# Altium project MotorControl.PrjPcb (part 2 of 2)

## Sheet HVin.SchDoc
size A; SheetNumber: 5; SheetTotal: 5
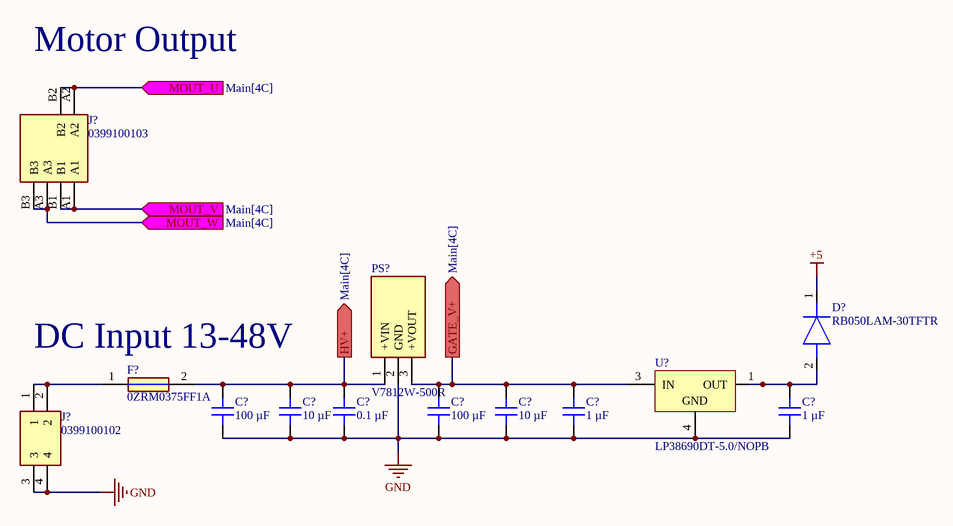
[diagram p3: HVin.SchDoc]

### Parts
(Parts that share a designator on the sheet are numbered #1, #2 ... from top to bottom, then left to right.)
C?#27  100 µF  [CAP 1206_3216 - 0.8MM]
C?#28  10 µF  [CAP 1206_3216 - 0.8MM]
C?#29  0.1 µF  [CAP 1206_3216 - 0.8MM]
C?#30  100 µF  [CAP 1206_3216 - 0.8MM]
C?#31  10 µF  [CAP 1206_3216 - 0.8MM]
C?#32  1 µF  [CAP 1206_3216 - 0.8MM]
C?#33  1 µF  [CAP 1206_3216 - 0.8MM]
D?#7  RB050LAM-30TFTR  [SODFL4725X95N]
F?#2  0ZRM0375FF1A  [0ZRM0375FF1A]
J?#3  0399100103  [0399100103]
J?#4  0399100102  [0399100102]
PS?  V7812W-500R  [V78121000R]
U?#2  LP38690DT-5.0/NOPB  [NDP0003B_M]

### Ports
GATE_V+ (out, see Main[4C]), HV+ (out, see Main[4C]), MOUT_U (in, see Main[4C]), MOUT_V (in, see Main[4C]), MOUT_W (in, see Main[4C])

### Nets
+5: D?#7.1(K)
GND: C?#27.1 C?#28.1 C?#29.1 C?#30.1 C?#31.1 C?#32.1 C?#33.1 J?#4.3 J?#4.4 PS?.2(GND) U?#2.4(GND)
12VOUT: C?#30.2 C?#31.2 C?#32.2 PS?.3(+VOUT) U?#2.3(IN) ; port GATE_V+
NetC?#27_2: C?#27.2 C?#28.2 C?#29.2 F?#2.2 PS?.1(+VIN) ; port HV+
NetC?#33_2: C?#33.2 D?#7.2(A) U?#2.1(OUT)
NetF?#2_1: F?#2.1 J?#4.1 J?#4.2
NetJ?#3_A1: J?#3.A1 J?#3.B1 ; port MOUT_V
NetJ?#3_A2: J?#3.A2 J?#3.B2 ; port MOUT_U
NetJ?#3_A3: J?#3.A3 J?#3.B3 ; port MOUT_W

### Notes on the sheet
- Motor Output
- DC Input 13-48V

### Library data of the parts
C?#27 C?#30 = C3216X5R0J107M160AB: CAP CER 100UF 6.3V X5R 1206; manufacturer: TDK Corporation; Tolerance: ±20%; Part Number: C3216X5R0J107M160AB; Value: 100 µF; Applications: General Purpose; Capacitance: 100 µF; componentlink1description: Datasheet; componentlink1url: https://product.tdk.com/info/en/catalog/datasheets/mlcc_commercial_general_en.pdf?ref_disty=digikey; componentlink2description: DigiKey Link; componentlink2url: https://www.digikey.com/en/products/detail/tdk-corporation/C3216X5R0J107M160AB/2443486; Device Package: 1206 (3216 Metric); Features: Low ESL; lastupdated: 2/6/2023 8:14:29 PM; Lifecycle Status: Active; Minimum Order: 1; Mounting Type: Surface Mount, MLCC; Operating Temperature: -55°C ~ 85°C; Package / Case: 1206 (3216 Metric); packaging: TapeAndReel; partid: 21199; Part Status: Active; price: 0.29; series: C; Size / Dimension: 0.126" L x 0.063" W (3.20mm x 1.60mm); Supplier 1: DigiKey; Supplier Part Number 1: 445-6008-1-ND; Temperature Coefficient: X5R; Thickness (Max): 0.075" (1.90mm); Voltage - Rated: 6.3V
C?#28 C?#31 = GRM31CR71E106KA12K: CAP CER 10UF 25V X7R 1206; manufacturer: Murata Electronics; Tolerance: ±10%; Part Number: GRM31CR71E106KA12K; Value: 10 µF; Applications: General Purpose; Capacitance: 10 µF; componentlink1description: Datasheet; componentlink1url: https://search.murata.co.jp/Ceramy/image/img/A01X/G101/ENG/GRM31CR71E106KA12-01.pdf; componentlink2description: DigiKey Link; componentlink2url: https://www.digikey.com/en/products/detail/murata-electronics/GRM31CR71E106KA12K/4905618; Device Package: 1206 (3216 Metric); lastupdated: 2/6/2023 8:14:40 PM; Lifecycle Status: Active; Minimum Order: 1; Mounting Type: Surface Mount, MLCC; Operating Temperature: -55°C ~ 125°C; Package / Case: 1206 (3216 Metric); packaging: TapeAndReel; partid: 19493; Part Status: Active; price: 0.06; series: GRM; Size / Dimension: 0.126" L x 0.063" W (3.20mm x 1.60mm); Supplier 1: DigiKey; Supplier Part Number 1: 490-14678-1-ND; Temperature Coefficient: X7R; Thickness (Max): 0.071" (1.80mm); Voltage - Rated: 25V
C?#29 = CC1206MRY5V9BB104: CAP CER 0.1UF 50V Y5V 1206; manufacturer: Yageo; Temperature Coefficient: Y5V (F); Tolerance: ±20%; Part Number: CC1206MRY5V9BB104; Value: 0.1 µF; Applications: General Purpose; Capacitance: 0.1 µF; componentlink1description: Datasheet; componentlink1url: http://www.yageo.com/documents/recent/UPY-GPHC_Y5V_6.3V-to-50V_8.pdf; componentlink2description: DigiKey Link; componentlink2url: https://www.digikey.com/en/products/detail/yageo/CC1206MRY5V9BB104/5884674; Device Package: 1206 (3216 Metric); lastupdated: 2/6/2023 8:14:35 PM; Lifecycle Status: Active; Minimum Order: 1; Mounting Type: Surface Mount, MLCC; Operating Temperature: -30°C ~ 85°C; Package / Case: 1206 (3216 Metric); packaging: TapeAndReel; partid: 18711; Part Status: Active; price: 0.05; series: CC; Size / Dimension: 0.126" L x 0.063" W (3.20mm x 1.60mm); Supplier 1: DigiKey; Supplier Part Number 1: 311-4504-1-ND; Thickness (Max): 0.028" (0.70mm); Voltage - Rated: 50V
C?#32 C?#33 = CC1206KKX7R8BB105: CAP CER 1UF 25V X7R 1206; manufacturer: Yageo; Tolerance: ±10%; Part Number: CC1206KKX7R8BB105; Value: 1 µF; Applications: General Purpose; Capacitance: 1 µF; componentlink1description: Datasheet; componentlink1url: https://www.yageo.com/upload/media/product/productsearch/datasheet/mlcc/UPY-GPHC_X7R_6.3V-to-50V_18.pdf; componentlink2description: DigiKey Link; componentlink2url: https://www.digikey.com/en/products/detail/yageo/CC1206KKX7R8BB105/2103094; Device Package: 1206 (3216 Metric); lastupdated: 2/6/2023 8:14:35 PM; Lifecycle Status: Active; Minimum Order: 1; Mounting Type: Surface Mount, MLCC; Operating Temperature: -55°C ~ 125°C; Package / Case: 1206 (3216 Metric); packaging: TapeAndReel; partid: 18923; Part Status: Active; price: 0.03; series: CC; Size / Dimension: 0.126" L x 0.063" W (3.20mm x 1.60mm); Supplier 1: DigiKey; Supplier Part Number 1: 311-1356-1-ND; Temperature Coefficient: X7R; Thickness (Max): 0.045" (1.15mm); Voltage - Rated: 25V
D?#7 = RB050LAM-30TFTR: Diode; Manufacturer_Name: ROHM Semiconductor; Datasheet Link: https://componentsearchengine.com/Datasheets/1/RB050LAM-30TFTR.pdf; Height: 0.95mm; Manufacturer_Part_Number: RB050LAM-30TFTR; Mouser Part Number: 755-RB050LAM-30TFTR; Mouser Price/Stock: https://www.mouser.co.uk/ProductDetail/ROHM-Semiconductor/RB050LAM-30TFTR?qs=HXFqYaX1Q2xO84kRCTSWAQ%3D%3D
F?#2 = 0ZRM0375FF1A: Fuse; Manufacturer_Name: BelFuse; Datasheet Link: https://www.mouser.com/datasheet/2/643/ds-CP-0zrm-series-1664109.pdf; Height: 34mm; Manufacturer_Part_Number: 0ZRM0375FF1A; Mouser Part Number: 530-0ZRM0375FF1A; Mouser Price/Stock: https://www.mouser.co.uk/ProductDetail/Bel-Fuse/0ZRM0375FF1A?qs=MvPYbBWWJyvr16E%252BkpbJXQ%3D%3D
J?#3 = 0399100103: Connector; Manufacturer_Name: Molex; Datasheet Link: https://www.molex.com/pdm_docs/sd/399100103_sd.pdf; Height: 30mm; Manufacturer_Part_Number: 0399100103; Mouser Part Number: N/A; Mouser Price/Stock: https://www.mouser.co.uk/ProductDetail/Molex/0399100103?qs=%252BdQmOuGyFcE%2Fyr5UJhNqQA%3D%3D; Arrow Part Number: 0399100103; Arrow Price/Stock: https://www.arrow.com/en/products/0399100103/molex?region=nac
J?#4 = 0399100102: Connector; Manufacturer_Name: Molex; Datasheet Link: https://www.molex.com/pdm_docs/sd/399100102_sd.pdf; Height: 29.7mm; Manufacturer_Part_Number: 0399100102; Mouser Part Number: N/A; Mouser Price/Stock: https://www.mouser.co.uk/ProductDetail/Molex/0399100102?qs=PBcRNPEHKso3EAnX8hJm1w%3D%3D; Arrow Part Number: 0399100102; Arrow Price/Stock: https://www.arrow.com/en/products/0399100102/molex
PS? = V7812W-500R: Power Supply; Manufacturer_Name: CUI Inc.; Datasheet Link: https://www.cui.com/product/resource/v78xx-1000.pdf; Height: 9mm; Manufacturer_Part_Number: V7812W-500R; Mouser Part Number: 490-V7812W-500R; Mouser Price/Stock: https://www.mouser.co.uk/ProductDetail/CUI-Inc/V7812W-500R?qs=WyjlAZoYn5223%2F9I6AQjMw%3D%3D; Arrow Part Number: V7812W-500R; Arrow Price/Stock: https://www.arrow.com/en/products/v7812w-500r/cui-inc
U?#2 = CMP-0062-00280-3: 1A Low Dropout CMOS Linear Regulators Stable with Ceramic Output Capacitors, 3-pin TO-252, Pb-Free; Manufacturer: Texas Instruments; PackageTopMarking: NSUZXYTT*LP38690*DT-5.0; CompType: LDO IC; PowerWise: Y; ComponentLink1URL: http://www.ti.com/general/docs/lit/getliterature.tsp?genericPartNumber=LP38690&fileType=pdf; RoHS: Y; ComponentLink1Description: Datasheet URL; PackageDescription: TO252, Molded, Jedec, 6.8 x 6.10 x 2.30mm Body, 3 Lead, 2.28mm Pitch, Surface Mount; Code_JEDEC: TO-252-AA; PinCount: 3; PackageReference: NDP0003B

## Sheet Gating.SchDoc
size A; SheetNumber: 4; SheetTotal: 6
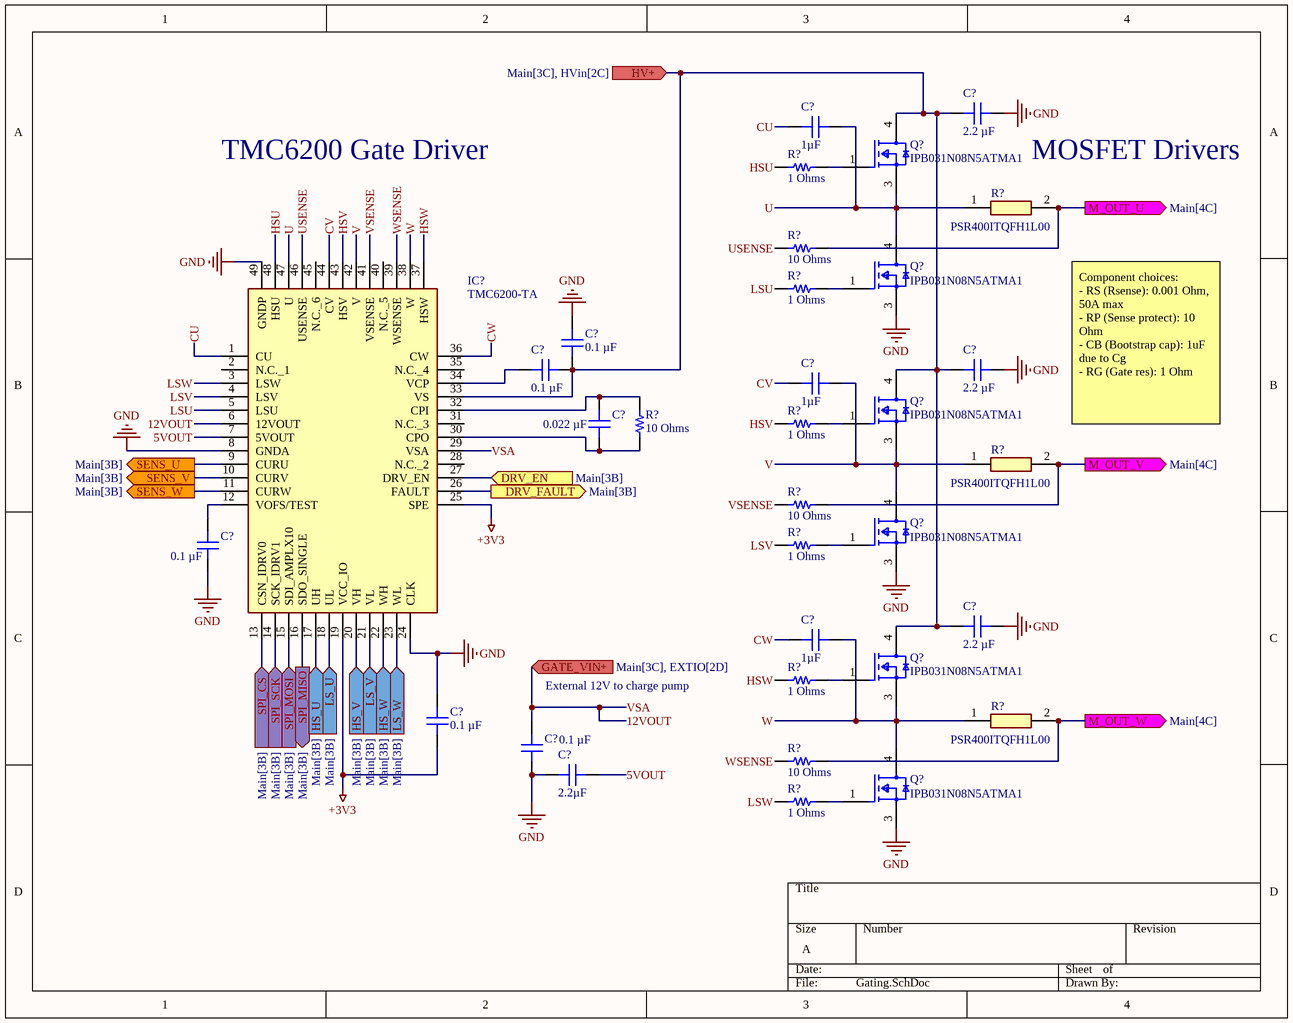
[diagram p4: Gating.SchDoc]

### Parts
(Parts that share a designator on the sheet are numbered #1, #2 ... from top to bottom, then left to right.)
C?#34  2.2 µF  [CAP 0805_2012]
C?#35  1µF  [CAP 1210_3225 - 2.8MM]
C?#36  0.1 µF  [CAP 1206_3216 - 0.8MM]
C?#37  0.1 µF  [CAP 1206_3216 - 0.8MM]
C?#38  2.2 µF  [CAP 0805_2012]
C?#39  1µF  [CAP 1210_3225 - 2.8MM]
C?#40  0.022 µF  [CAP 1206_3216 - 0.8MM]
C?#41  0.1 µF  [CAP 0603_1608]
C?#42  2.2 µF  [CAP 0805_2012]
C?#43  1µF  [CAP 1210_3225 - 2.8MM]
C?#44  0.1 µF  [CAP 0603_1608]
C?#45  0.1 µF  [CAP 1206_3216 - 0.8MM]
C?#46  2.2µF  [CAP 1206_3216 - 1.2MM]
IC?#4  TMC6200-TA  [QFP50P900X900X120-49N]
Q?#2  IPB031N08N5ATMA1  [FP-PG-TO263-3-MFG]
Q?#3  IPB031N08N5ATMA1  [FP-PG-TO263-3-MFG]
Q?#4  IPB031N08N5ATMA1  [FP-PG-TO263-3-MFG]
Q?#5  IPB031N08N5ATMA1  [FP-PG-TO263-3-MFG]
Q?#6  IPB031N08N5ATMA1  [FP-PG-TO263-3-MFG]
Q?#7  IPB031N08N5ATMA1  [FP-PG-TO263-3-MFG]
R?#15  1 Ohms  [RES 1210_3225]
R?#16  PSR400ITQFH1L00  [RESC10052X105N]
R?#17  10 Ohms  [RES 1210_3225]
R?#18  1 Ohms  [RES 1210_3225]
R?#19  10 Ohms  [RES 0603_1608]
R?#20  1 Ohms  [RES 1210_3225]
R?#21  PSR400ITQFH1L00  [RESC10052X105N]
R?#22  10 Ohms  [RES 1210_3225]
R?#23  1 Ohms  [RES 1210_3225]
R?#24  1 Ohms  [RES 1210_3225]
R?#25  PSR400ITQFH1L00  [RESC10052X105N]
R?#26  10 Ohms  [RES 1210_3225]
R?#27  1 Ohms  [RES 1210_3225]

### Ports
DRV_EN (in, see Main[3B]), DRV_FAULT (out, see Main[3B]), GATE_VIN+ (in, see Main[3C], EXTIO[2D]), HS_U (in, see Main[3B]), HS_V (in, see Main[3B]), HS_W (in, see Main[3B]), HV+ (in, see Main[3C], HVin[2C]), LS_U (in, see Main[3B]), LS_V (in, see Main[3B]), LS_W (in, see Main[3B]), M_OUT_U (out, see Main[4C]), M_OUT_V (out, see Main[4C]), M_OUT_W (out, see Main[4C]), SENS_U (out, see Main[3B]), SENS_V (out, see Main[3B]), SENS_W (out, see Main[3B]), SPI_CS (in, see Main[3B]), SPI_MISO (out, see Main[3B]), SPI_MOSI (in, see Main[3B]), SPI_SCK (in, see Main[3B])

### Nets
+3V3: C?#44.1 IC?#4.19(VCC_IO) IC?#4.25(SPE)
GND: C?#34.1 C?#36.2 C?#38.1 C?#41.1 C?#42.1 C?#44.2 C?#45.1 C?#46.1 IC?#4.8(GNDA) IC?#4.24(CLK) IC?#4.49(GNDP) Q?#3.3(S) Q?#5.3(S) Q?#7.3(S)
5VOUT: C?#46.2 IC?#4.7(5VOUT)
12VOUT: C?#45.2 IC?#4.6(12VOUT) IC?#4.29(VSA) ; port GATE_VIN+  [also labelled VSA]
CU: C?#35.1 IC?#4.1(CU)
CV: C?#39.1 IC?#4.44(CV)
CW: C?#43.1 IC?#4.36(CW)
HSU: IC?#4.48(HSU) R?#15.1
HSV: IC?#4.43(HSV) R?#20.1
HSW: IC?#4.37(HSW) R?#24.1
LSU: IC?#4.5(LSU) R?#18.1
LSV: IC?#4.4(LSV) R?#23.1
LSW: IC?#4.3(LSW) R?#27.1
U: C?#35.2 IC?#4.47(U) Q?#2.3(S) Q?#3.4(D) R?#16.1
USENSE: IC?#4.46(USENSE) R?#17.1
V: C?#39.2 IC?#4.42(V) Q?#4.3(S) Q?#5.4(D) R?#21.1
VSENSE: IC?#4.41(VSENSE) R?#22.1
W: C?#43.2 IC?#4.38(W) Q?#6.3(S) Q?#7.4(D) R?#25.1
WSENSE: IC?#4.39(WSENSE) R?#26.1
NetC?#27_2: C?#34.2 C?#36.1 C?#37.2 C?#38.2 C?#42.2 IC?#4.33(VS) Q?#2.4(D) Q?#4.4(D) Q?#6.4(D) ; port HV+
NetC?#37_1: C?#37.1 IC?#4.34(VCP)
NetC?#40_1: C?#40.1 IC?#4.30(CPO) R?#19.1
NetC?#40_2: C?#40.2 IC?#4.32(CPI) R?#19.2
NetC?#41_2: C?#41.2 IC?#4.12(VOFS/TEST)
NetIC?#4_9: IC?#4.9(CURU) ; port SENS_U
NetIC?#4_10: IC?#4.10(CURV) ; port SENS_V
NetIC?#4_11: IC?#4.11(CURW) ; port SENS_W
NetIC?#4_13: IC?#4.13(CSN_IDRV0) ; port SPI_CS
NetIC?#4_14: IC?#4.14(SCK_IDRV1) ; port SPI_SCK
NetIC?#4_15: IC?#4.15(SDI_AMPLX10) ; port SPI_MOSI
NetIC?#4_16: IC?#4.16(SDO_SINGLE) ; port SPI_MISO
NetIC?#4_17: IC?#4.17(UH) ; port HS_U
NetIC?#4_18: IC?#4.18(UL) ; port LS_U
NetIC?#4_20: IC?#4.20(VH) ; port HS_V
NetIC?#4_21: IC?#4.21(VL) ; port LS_V
NetIC?#4_22: IC?#4.22(WH) ; port HS_W
NetIC?#4_23: IC?#4.23(WL) ; port LS_W
NetIC?#4_26: IC?#4.26(FAULT) ; port DRV_FAULT
NetIC?#4_27: IC?#4.27(DRV_EN) ; port DRV_EN
NetJ?#3_A1: R?#21.2 R?#22.2 ; port M_OUT_V
NetJ?#3_A2: R?#16.2 R?#17.2 ; port M_OUT_U
NetJ?#3_A3: R?#25.2 R?#26.2 ; port M_OUT_W
NetQ?#2_1: Q?#2.1(G) R?#15.2
NetQ?#3_1: Q?#3.1(G) R?#18.2
NetQ?#4_1: Q?#4.1(G) R?#20.2
NetQ?#5_1: Q?#5.1(G) R?#23.2
NetQ?#6_1: Q?#6.1(G) R?#24.2
NetQ?#7_1: Q?#7.1(G) R?#27.2

Not connected (* = marked no-connect by the designer): IC?#4 2(N.C._1) 28(N.C._2) 31(N.C._3) 35(N.C._4) 40(N.C._5) 45(N.C._6)

### Notes on the sheet
- TMC6200 Gate Driver
- MOSFET Drivers
- Component choices:
  - RS (Rsense): 0.001 Ohm, 50A max
  - RP (Sense protect): 10 Ohm
  - CB (Bootstrap cap): 1uF due to Cg
  - RG (Gate res): 1 Ohm
- (near C?#45) External 12V to charge pump

### Library data of the parts
C?#34 C?#38 C?#42 = GRM21BD72A225KE01L: CAP CER 2.2UF 100V X7T 0805; manufacturer: Murata Electronics; Tolerance: ±10%; Part Number: GRM21BD72A225KE01L; Value: 2.2 µF; Applications: General Purpose; Capacitance: 2.2 µF; componentlink1description: Datasheet; componentlink1url: https://search.murata.co.jp/Ceramy/image/img/A01X/G101/ENG/GRM21BD72A225KE01-01A.pdf; componentlink2description: DigiKey Link; componentlink2url: https://www.digikey.com/en/products/detail/murata-electronics/GRM21BD72A225KE01L/16033492; Device Package: 0805 (2012 Metric); lastupdated: 2/6/2023 8:10:57 PM; Lifecycle Status: Active; Minimum Order: 1; Mounting Type: Surface Mount, MLCC; Operating Temperature: -55°C ~ 125°C; Package / Case: 0805 (2012 Metric); packaging: TapeAndReel; partid: 42420; Part Status: Active; price: 0.13; series: GRM; Size / Dimension: 0.079" L x 0.049" W (2.00mm x 1.25mm); Supplier 1: DigiKey; Supplier Part Number 1: 490-GRM21BD72A225KE01LCT-ND; Temperature Coefficient: X7T; Thickness (Max): 0.057" (1.45mm); Voltage - Rated: 100V
C?#35 C?#39 C?#43 = 12101C105MAT2A: CAP CER 1UF 100V X7R 1210; manufacturer: AVX Corporation; Tolerance: ±20%; Part Number: 12101C105MAT2A; Value: 1µF; Applications: General Purpose; Capacitance: 1µF; componentlink1description: Datasheet; componentlink1url: http://datasheets.avx.com/X7RDielectric.pdf; componentlink2description: DigiKey Link; componentlink2url: http://digikey.com/product-detail/en/avx-corporation/12101C105MAT2A/478-2571-1-ND/717516; Device Package: 1210 (3225 Metric); lastupdated: 9/2/2020 1:10:52 AM; Lifecycle Status: Active; Minimum Order: 1; Mounting Type: Surface Mount, MLCC; Operating Temperature: -55°C ~ 125°C; Package / Case: 1210 (3225 Metric); packaging: TapeAndReel; partid: 23736; Part Status: Active; price: 0.21; series: -; Size / Dimension: 0.126" L x 0.098" W (3.20mm x 2.50mm); Supplier 1: DigiKey; Supplier Part Number 1: 478-2571-1-ND; Temperature Coefficient: X7R; Thickness (Max): 0.110" (2.79mm); Voltage - Rated: 100V
C?#36 C?#37 C?#45 = CC1206MRY5V9BB104: as C?#29 on sheet HVin; Part Number: CC1206MRY5V9BB104; Value: 0.1 µF; Applications: General Purpose; Capacitance: 0.1 µF; componentlink1description: Datasheet; componentlink1url: http://www.yageo.com/documents/recent/UPY-GPHC_Y5V_6.3V-to-50V_8.pdf; componentlink2description: DigiKey Link; componentlink2url: https://www.digikey.com/en/products/detail/yageo/CC1206MRY5V9BB104/5884674; Device Package: 1206 (3216 Metric); lastupdated: 2/6/2023 8:14:35 PM; Lifecycle Status: Active; Minimum Order: 1; Mounting Type: Surface Mount, MLCC; Operating Temperature: -30°C ~ 85°C; Package / Case: 1206 (3216 Metric); packaging: TapeAndReel; partid: 18711; Part Status: Active; price: 0.05; series: CC; Size / Dimension: 0.126" L x 0.063" W (3.20mm x 1.60mm); Supplier 1: DigiKey; Supplier Part Number 1: 311-4504-1-ND; Thickness (Max): 0.028" (0.70mm); Voltage - Rated: 50V
C?#40 = C1206C223K1RECAUTO: CAP CER 1206 22NF 100V X7R 10%; manufacturer: KEMET; Part Number: C1206C223K1RECAUTO; Value: 0.022 µF; Applications: Automotive, ESD Protection; Capacitance: 0.022 µF; componentlink1description: Datasheet; componentlink1url: https://api.kemet.com/component-edge/download/datasheet/C1206C223K1RECAUTO.pdf; componentlink2description: DigiKey Link; componentlink2url: https://www.digikey.com/en/products/detail/kemet/C1206C223K1RECAUTO/8640492; Device Package: 1206 (3216 Metric); lastupdated: 2/6/2023 8:14:07 PM; Lifecycle Status: Active; Minimum Order: 1; Mounting Type: Surface Mount, MLCC; Operating Temperature: -55°C ~ 125°C; Package / Case: 1206 (3216 Metric); packaging: TapeAndReel; partid: 21022; Part Status: Active; price: 0.03; Ratings: AEC-Q200; series: ESD SMD Auto X7R; Size / Dimension: 0.126" L x 0.063" W (3.20mm x 1.60mm); Supplier 1: DigiKey; Supplier Part Number 1: 399-17898-1-ND; Temperature Coefficient: X7R; Thickness (Max): 0.035" (0.88mm); Tolerance: ±10%; Voltage - Rated: 100V
C?#41 C?#44 = CS0603KRX7R7BB104: CAP CER 0.1UF 16V X7R 0603; manufacturer: Yageo; Tolerance: ±10%; Part Number: CS0603KRX7R7BB104; Value: 0.1 µF; Applications: Boardflex Sensitive; Capacitance: 0.1 µF; componentlink1description: Datasheet; componentlink1url: http://www.yageo.com/NewPortal/yageodocoutput?fileName=/pdf/MLCC/UPY-ST_NPOX7R_16V-to-3KV_5.pdf; componentlink2description: DigiKey Link; componentlink2url: https://www.digikey.com/en/products/detail/yageo/CS0603KRX7R7BB104/6097897; Device Package: 0603 (1608 Metric); Features: Soft Termination; lastupdated: 2/6/2023 8:08:52 PM; Lifecycle Status: Active; Minimum Order: 1; Mounting Type: Surface Mount, MLCC; Operating Temperature: -55°C ~ 125°C; Package / Case: 0603 (1608 Metric); packaging: TapeAndReel; partid: 2286; Part Status: Active; price: 0.01; series: CS; Size / Dimension: 0.063" L x 0.031" W (1.60mm x 0.80mm); Supplier 1: DigiKey; Supplier Part Number 1: 311-3560-1-ND; Temperature Coefficient: X7R; Thickness (Max): 0.037" (0.95mm); Voltage - Rated: 16V
C?#46 = 12063G225ZAT4A: CAP CER 2.2UF 25V Y5V 1206; manufacturer: AVX Corporation; Temperature Coefficient: Y5V (F); Tolerance: -20%, +80%; Part Number: 12063G225ZAT4A; Value: 2.2µF; Applications: General Purpose; Capacitance: 2.2µF; componentlink1description: Datasheet; componentlink1url: http://datasheets.avx.com/Y5V.pdf; componentlink2description: DigiKey Link; componentlink2url: http://digikey.com/product-detail/en/avx-corporation/12063G225ZAT4A/478-12479-1-ND/9749331; Device Package: 1206 (3216 Metric); lastupdated: 9/2/2020 1:05:10 AM; Lifecycle Status: Active; Minimum Order: 1; Mounting Type: Surface Mount, MLCC; Operating Temperature: -30°C ~ 85°C; Package / Case: 1206 (3216 Metric); packaging: TapeAndReel; partid: 18984; Part Status: Active; price: 0.09; series: -; Size / Dimension: 0.126" L x 0.063" W (3.20mm x 1.60mm); Supplier 1: DigiKey; Supplier Part Number 1: 478-12479-1-ND; Thickness (Max): 0.040" (1.02mm); Voltage - Rated: 25V
IC?#4 = TMC6200-TA: Integrated Circuit; Manufacturer_Name: Trinamic Motion Control GmbH; Datasheet Link: https://datasheet.datasheetarchive.com/originals/distributors/Datasheets_SAMA/f9acd441643b32190a486ba2a99356a2.pdf; Height: 1.2mm; Manufacturer_Part_Number: TMC6200-TA
Q?#2-Q?#7 = CMP-32901-001127-1: MOSFET N-CH 80V 120A D2PAK; Element Configuration: Single; Gate to Source Voltage (Vgs): 20V; Rise Time: 18ns; Rds On Max: 3.1mR; Drain to Source Resistance: 4.1mR; Number of Channels: 1; Fall Time: 12ns; Max Power Dissipation: 167W; Turn-Off Delay Time: 37ns; Polarity: N-CHANNEL; Input Capacitance: 6.24nF; Max Operating Temperature: 175°C; Packaging: Tape and Reel; Package Quantity: 1000; Lead Free: Contains Lead; Min Operating Temperature: -55°C; Drain to Source Voltage (Vdss): 80V; Mount: Surface Mount; Max Dual Supply Voltage: 80V; RoHS Compliant: Yes; Weight: 0.139332oz; Turn-On Delay Time: 18ns; Halogen Free: Halogen Free; Drain to Source Breakdown Voltage: 80V; Series: OptiMOS™; Case/Package: TO-263-3; Continuous Drain Current (ID): 120A; Number of Pins: 3
R?#15 R?#18 R?#20 R?#23 R?#24 R?#27 = RK73B2ETTD1R0J: RES 1 OHM 5% 1/2W 1210; Manufacturer: KOA Speer Electronics, Inc.; Power (Watts): 0.5W, 1/2W; Temperature Coefficient: ±200ppm/°C; Part Number: RK73B2ETTD1R0J; ComponentLink1Description: Datasheet; ComponentLink1URL: http://www.koaspeer.com/catimages/Products/RK73B/RK73B.pdf; ComponentLink2Description: DigiKey Link; ComponentLink2URL: https://www.digikey.com/en/products/detail/koa-speer-electronics-inc/RK73B2ETTD1R0J/10315032; Composition: Thick Film; Device Package: 1210 (3225 Metric); Features: Automotive AEC-Q200; Height - Seated (Max): 0.028" (0.70mm); LastUpdated: 2/6/2023 9:02:08 PM; Lifecycle Status: Active; Minimum Order: 1; Number of Terminations: 2; Operating Temperature: -55°C ~ 155°C; Package / Case: 1210 (3225 Metric); Packaging: TapeAndReel; Part Status: Active; Price: 0.02; Ratings: AEC-Q200; Resistance: 1 Ohms; Series: RK73B; Size / Dimension: 0.126" L x 0.063" W (3.20mm x 1.60mm); Supplier 1: DigiKey; Supplier Part Number 1: 2019-RK73B2ETTD1R0JCT-ND; Supplier Device Package: 1210; Tolerance: ±5%; Value: 1 Ohms
R?#16 R?#21 R?#25 = PSR400ITQFH1L00: Resistor; Manufacturer_Name: ROHM Semiconductor; Datasheet Link: https://datasheet.datasheetarchive.com/originals/distributors/DKDS-18/356551.pdf; Height: 1.05mm; Manufacturer_Part_Number: PSR400ITQFH1L00; Mouser Part Number: 755-PSR400ITQFH1L00; Mouser Price/Stock: https://www.mouser.co.uk/ProductDetail/ROHM-Semiconductor/PSR400ITQFH1L00?qs=493kPxzlxfKMrnsSE5rdTg%3D%3D
R?#17 R?#22 R?#26 = RN73R2ETTD10R0F25: RESISTOR THIN FILM 1210 SIZE; Manufacturer: KOA Speer Electronics, Inc.; Power (Watts): 0.25W, 1/4W; Temperature Coefficient: ±25ppm/°C; Tolerance: ±1%; Part Number: RN73R2ETTD10R0F25; ComponentLink1Description: Datasheet; ComponentLink1URL: https://www.koaspeer.com/pdfs/RN73R.pdf; ComponentLink2Description: DigiKey Link; ComponentLink2URL: https://www.digikey.com/en/products/detail/koa-speer-electronics-inc/RN73R2ETTD10R0F25/13211390; Composition: Metal Film; Device Package: 1210 (3225 Metric); Features: Automotive AEC-Q200, Moisture Resistant; Height - Seated (Max): 0.028" (0.70mm); LastUpdated: 2/6/2023 9:02:05 PM; Lifecycle Status: Active; Minimum Order: 1; Number of Terminations: 2; Operating Temperature: -55°C ~ 155°C; Package / Case: 1210 (3225 Metric); Packaging: TapeAndReel; Part Status: Active; Price: 0.16; Ratings: AEC-Q200; Resistance: 10 Ohms; Series: RN73R; Size / Dimension: 0.126" L x 0.098" W (3.20mm x 2.50mm); Supplier 1: DigiKey; Supplier Part Number 1: 2019-RN73R2ETTD10R0F25CT-ND; Supplier Device Package: 1210; Value: 10 Ohms
R?#19 = CPF0603B10RE: RES SMD 10 OHM 0.1% 1/16W 0603; Manufacturer: TE Connectivity Passive Product; Power (Watts): 0.063W, 1/16W; Temperature Coefficient: ±25ppm/°C; Part Number: CPF0603B10RE; Value: 10 Ohms; ComponentLink1Description: Datasheet; ComponentLink1URL: https://www.te.com/commerce/DocumentDelivery/DDEController?Action=srchrtrv&DocNm=1773200&DocType=DS&DocLang=English; ComponentLink2Description: DigiKey Link; ComponentLink2URL: https://www.digikey.com/en/products/detail/te-connectivity-passive-product/CPF0603B10RE/2381853; Composition: Thin Film; Device Package: 0603 (1608 Metric); Height - Seated (Max): 0.022" (0.55mm); LastUpdated: 2/5/2023 8:28:11 PM; Lifecycle Status: Active; Minimum Order: 1; Number of Terminations: 2; Operating Temperature: -55°C ~ 155°C; Package / Case: 0603 (1608 Metric); Packaging: TapeAndReel; PartId: 4879; Part Status: Active; Price: 0.09; Resistance: 10 Ohms; Series: CPF, Neohm; Size / Dimension: 0.061" L x 0.031" W (1.55mm x 0.80mm); Supplier 1: DigiKey; Supplier Part Number 1: A119908CT-ND; Supplier Device Package: 0603; Tolerance: ±0.1%

## Sheet EXTIO.SchDoc
size A; SheetNumber: 6; SheetTotal: 6
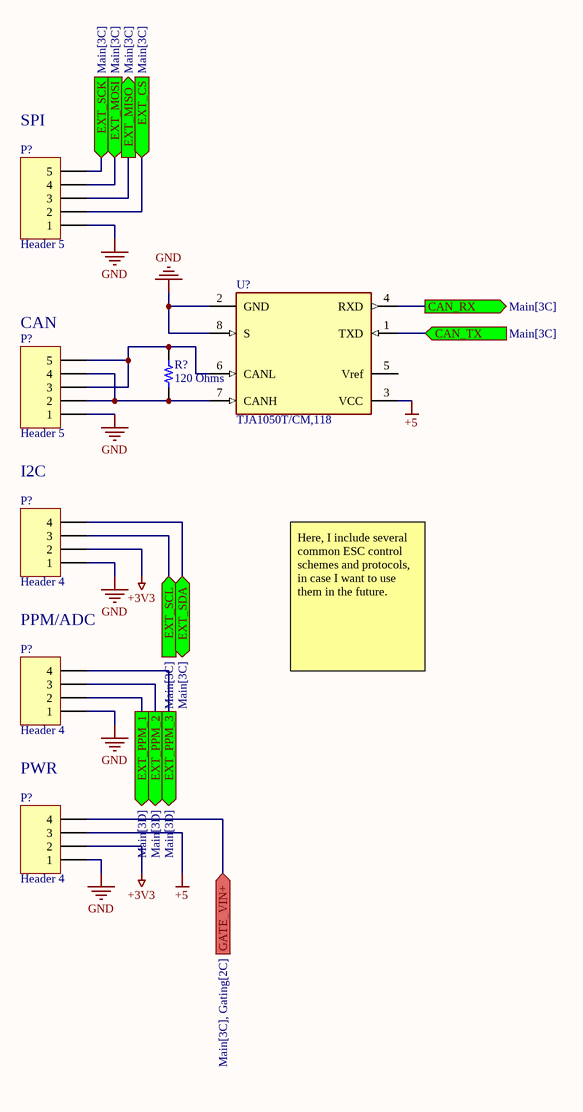
[diagram p5: EXTIO.SchDoc]

### Parts
(Parts that share a designator on the sheet are numbered #1, #2 ... from top to bottom, then left to right.)
P?#2  Header 5  [HDR1X5]
P?#3  Header 5  [HDR1X5]
P?#4  Header 4  [HDR1X4]
P?#5  Header 4  [HDR1X4]
P?#6  Header 4  [HDR1X4]
R?#28  120 Ohms  [RES 0603_1608]
U?#3  TJA1050T/CM,118  [FP-SOT96-1-IPC_A]

### Ports
CAN_RX (out, see Main[3C]), CAN_TX (in, see Main[3C]), EXT_CS (in, see Main[3C]), EXT_MISO (out, see Main[3C]), EXT_MOSI (in, see Main[3C]), EXT_PPM_1 (out, see Main[3D]), EXT_PPM_2 (out, see Main[3D]), EXT_PPM_3 (out, see Main[3D]), EXT_SCK (in, see Main[3C]), EXT_SCL (in, see Main[3C]), EXT_SDA (bidir, see Main[3C]), GATE_VIN+ (in, see Main[3C], Gating[2C])

### Nets
+3V3: P?#4.2 P?#6.2
+5: P?#6.3 U?#3.3(VCC)
GND: P?#2.1 P?#3.1 P?#4.1 P?#5.1 P?#6.1 U?#3.2(GND) U?#3.8(S)
12VOUT: P?#6.4 ; port GATE_VIN+
NetP?#2_2: P?#2.2 ; port EXT_CS
NetP?#2_3: P?#2.3 ; port EXT_MISO
NetP?#2_4: P?#2.4 ; port EXT_MOSI
NetP?#2_5: P?#2.5 ; port EXT_SCK
NetP?#3_2: P?#3.2 P?#3.4 R?#28.1 U?#3.7(CANH)
NetP?#3_3: P?#3.3 P?#3.5 R?#28.2 U?#3.6(CANL)
NetP?#4_3: P?#4.3 ; port EXT_SCL
NetP?#4_4: P?#4.4 ; port EXT_SDA
NetP?#5_2: P?#5.2 ; port EXT_PPM_1
NetP?#5_3: P?#5.3 ; port EXT_PPM_2
NetP?#5_4: P?#5.4 ; port EXT_PPM_3
NetU1_H13: U?#3.1(TXD) ; port CAN_TX
NetU1_M13: U?#3.4(RXD) ; port CAN_RX

Not connected (* = marked no-connect by the designer): U?#3 5(Vref)

### Notes on the sheet
- (near P?#2) SPI
- (near P?#3) CAN
- (near P?#4) I2C
- (near P?#5) PPM/ADC
- Here, I include several common ESC control schemes and protocols, in case I want to use them in the future.
- (near P?#6) PWR

### Library data of the parts
P?#2 P?#3 = Header 5: Header, 5-Pin; LatestRevisionDate: 17-Jul-2002; LatestRevisionNote: Re-released for DXP Platform.; Publisher: Altium Limited
P?#4-P?#6 = Header 4: Header, 4-Pin; LatestRevisionDate: 17-Jul-2002; LatestRevisionNote: Re-released for DXP Platform.; Publisher: Altium Limited
R?#28 = AC0603FR-07120RL: RES SMD 120 OHM 1% 1/10W 0603; Manufacturer: Yageo; Power (Watts): 0.1W, 1/10W; Temperature Coefficient: ±100ppm/°C; Part Number: AC0603FR-07120RL; Value: 120 Ohms; ComponentLink1Description: Datasheet; ComponentLink1URL: https://www.yageo.com/upload/media/product/productsearch/datasheet/rchip/PYu-AC_51_RoHS_L_7.pdf; ComponentLink2Description: DigiKey Link; ComponentLink2URL: https://www.digikey.com/en/products/detail/yageo/AC0603FR-07120RL/5895761; Composition: Thick Film; Device Package: 0603 (1608 Metric); Features: Automotive AEC-Q200, Moisture Resistant; Height - Seated (Max): 0.022" (0.55mm); LastUpdated: 2/5/2023 8:27:27 PM; Lifecycle Status: Active; Minimum Order: 1; Number of Terminations: 2; Operating Temperature: -55°C ~ 155°C; Package / Case: 0603 (1608 Metric); Packaging: CutTape; PartId: 17447; Part Status: Active; Price: 0.01; Ratings: AEC-Q200; Resistance: 120 Ohms; Series: AC; Size / Dimension: 0.063" L x 0.031" W (1.60mm x 0.80mm); Supplier 1: DigiKey; Supplier Part Number 1: YAG3563CT-ND; Supplier Device Package: 0603; Tolerance: ±1%
U?#3 = CMP-2000-04923-2: IC TRANSCEIVER HALF 1/1 8SO; Simplex/Duplex: Half Duplex; Max Supply Current: 10mA; Number of Receive Buffers: 1; Min Supply Voltage: 4.75V; Max Supply Voltage: 5.25V; Interface: CAN; Data Rate: 1Mbps; Receiver Hysteresis: 70mV; Number of Transmit Buffers: 1; Min Operating Temperature: -40°C; Case/Package: SO; REACH SVHC: No SVHC; Max Operating Temperature: 150°C; Number of Pins: 8; Lead Free: Lead Free; Number of Transceivers: 1; Packaging: Tape and Reel; Mount: Surface Mount; Radiation Hardening: No; Nominal Supply Current: 10mA; Package Quantity: 2500; Contact Plating: Gold

## Nets that join several sheets
+3V3: MCUCustom (17 pins), USBIO (7 pins), Gating (C?#44.1 IC?#4.19 IC?#4.25), EXTIO (P?#4.2 P?#6.2)
+5: MCUCustom (U1.N6 U1.P6), USBIO (11 pins), HVin (D?#7.1), EXTIO (P?#6.3 U?#3.3)
GND: MCUCustom (52 pins), USBIO (25 pins), HVin (11 pins), Gating (14 pins), EXTIO (7 pins)
12VOUT: HVin (5 pins), Gating (C?#45.2 IC?#4.6 IC?#4.29), EXTIO (P?#6.4)
HOST_D+: MCUCustom (U1.N7), USBIO (D?#6.4 J?#2.A6 J?#2.B6)
HOST_D-: MCUCustom (U1.P7), USBIO (D?#6.3 J?#2.A7 J?#2.B7)
NetC?#27_2: HVin (5 pins), Gating (9 pins)
NetIC?#4_9: MCUCustom (U1.L11), Gating (IC?#4.9)
NetIC?#4_10: MCUCustom (U1.M12), Gating (IC?#4.10)
NetIC?#4_11: MCUCustom (U1.K10), Gating (IC?#4.11)
NetIC?#4_13: MCUCustom (U1.D7), Gating (IC?#4.13)
NetIC?#4_14: MCUCustom (R?#1.2 U1.D8), Gating (IC?#4.14)
NetIC?#4_15: MCUCustom (U1.E8), Gating (IC?#4.15)
NetIC?#4_16: MCUCustom (U1.E7), Gating (IC?#4.16)
NetIC?#4_17: MCUCustom (U1.H3), Gating (IC?#4.17)
NetIC?#4_18: MCUCustom (U1.F2), Gating (IC?#4.18)
NetIC?#4_20: MCUCustom (U1.D9), Gating (IC?#4.20)
NetIC?#4_21: MCUCustom (U1.G5), Gating (IC?#4.21)
NetIC?#4_22: MCUCustom (U1.B11), Gating (IC?#4.22)
NetIC?#4_23: MCUCustom (U1.H5), Gating (IC?#4.23)
NetIC?#4_26: MCUCustom (U1.C5), Gating (IC?#4.26)
NetIC?#4_27: MCUCustom (U1.D5), Gating (IC?#4.27)
NetJ?#3_A1: HVin (J?#3.A1 J?#3.B1), Gating (R?#21.2 R?#22.2)
NetJ?#3_A2: HVin (J?#3.A2 J?#3.B2), Gating (R?#16.2 R?#17.2)
NetJ?#3_A3: HVin (J?#3.A3 J?#3.B3), Gating (R?#25.2 R?#26.2)
NetP?#2_2: MCUCustom (U1.G11), EXTIO (P?#2.2)
NetP?#2_3: MCUCustom (U1.M11), EXTIO (P?#2.3)
NetP?#2_4: MCUCustom (U1.G12), EXTIO (P?#2.4)
NetP?#2_5: MCUCustom (U1.J14), EXTIO (P?#2.5)
NetP?#4_3: MCUCustom (U1.J11), EXTIO (P?#4.3)
NetP?#4_4: MCUCustom (U1.K11), EXTIO (P?#4.4)
NetR?#12_2: MCUCustom (U1.A7), USBIO (R?#12.2 U?#1.4)
NetU1_H13: MCUCustom (U1.H13), EXTIO (U?#3.1)
NetU1_M13: MCUCustom (U1.M13), EXTIO (U?#3.4)
OUT_D+: MCUCustom (U1.L8), USBIO (D?#4.4 J?#1.A6 J?#1.B6)
OUT_D-: MCUCustom (U1.M8), USBIO (D?#4.3 J?#1.A7 J?#1.B7)